# Altium project W2-Tuner_7x7.PrjPcb
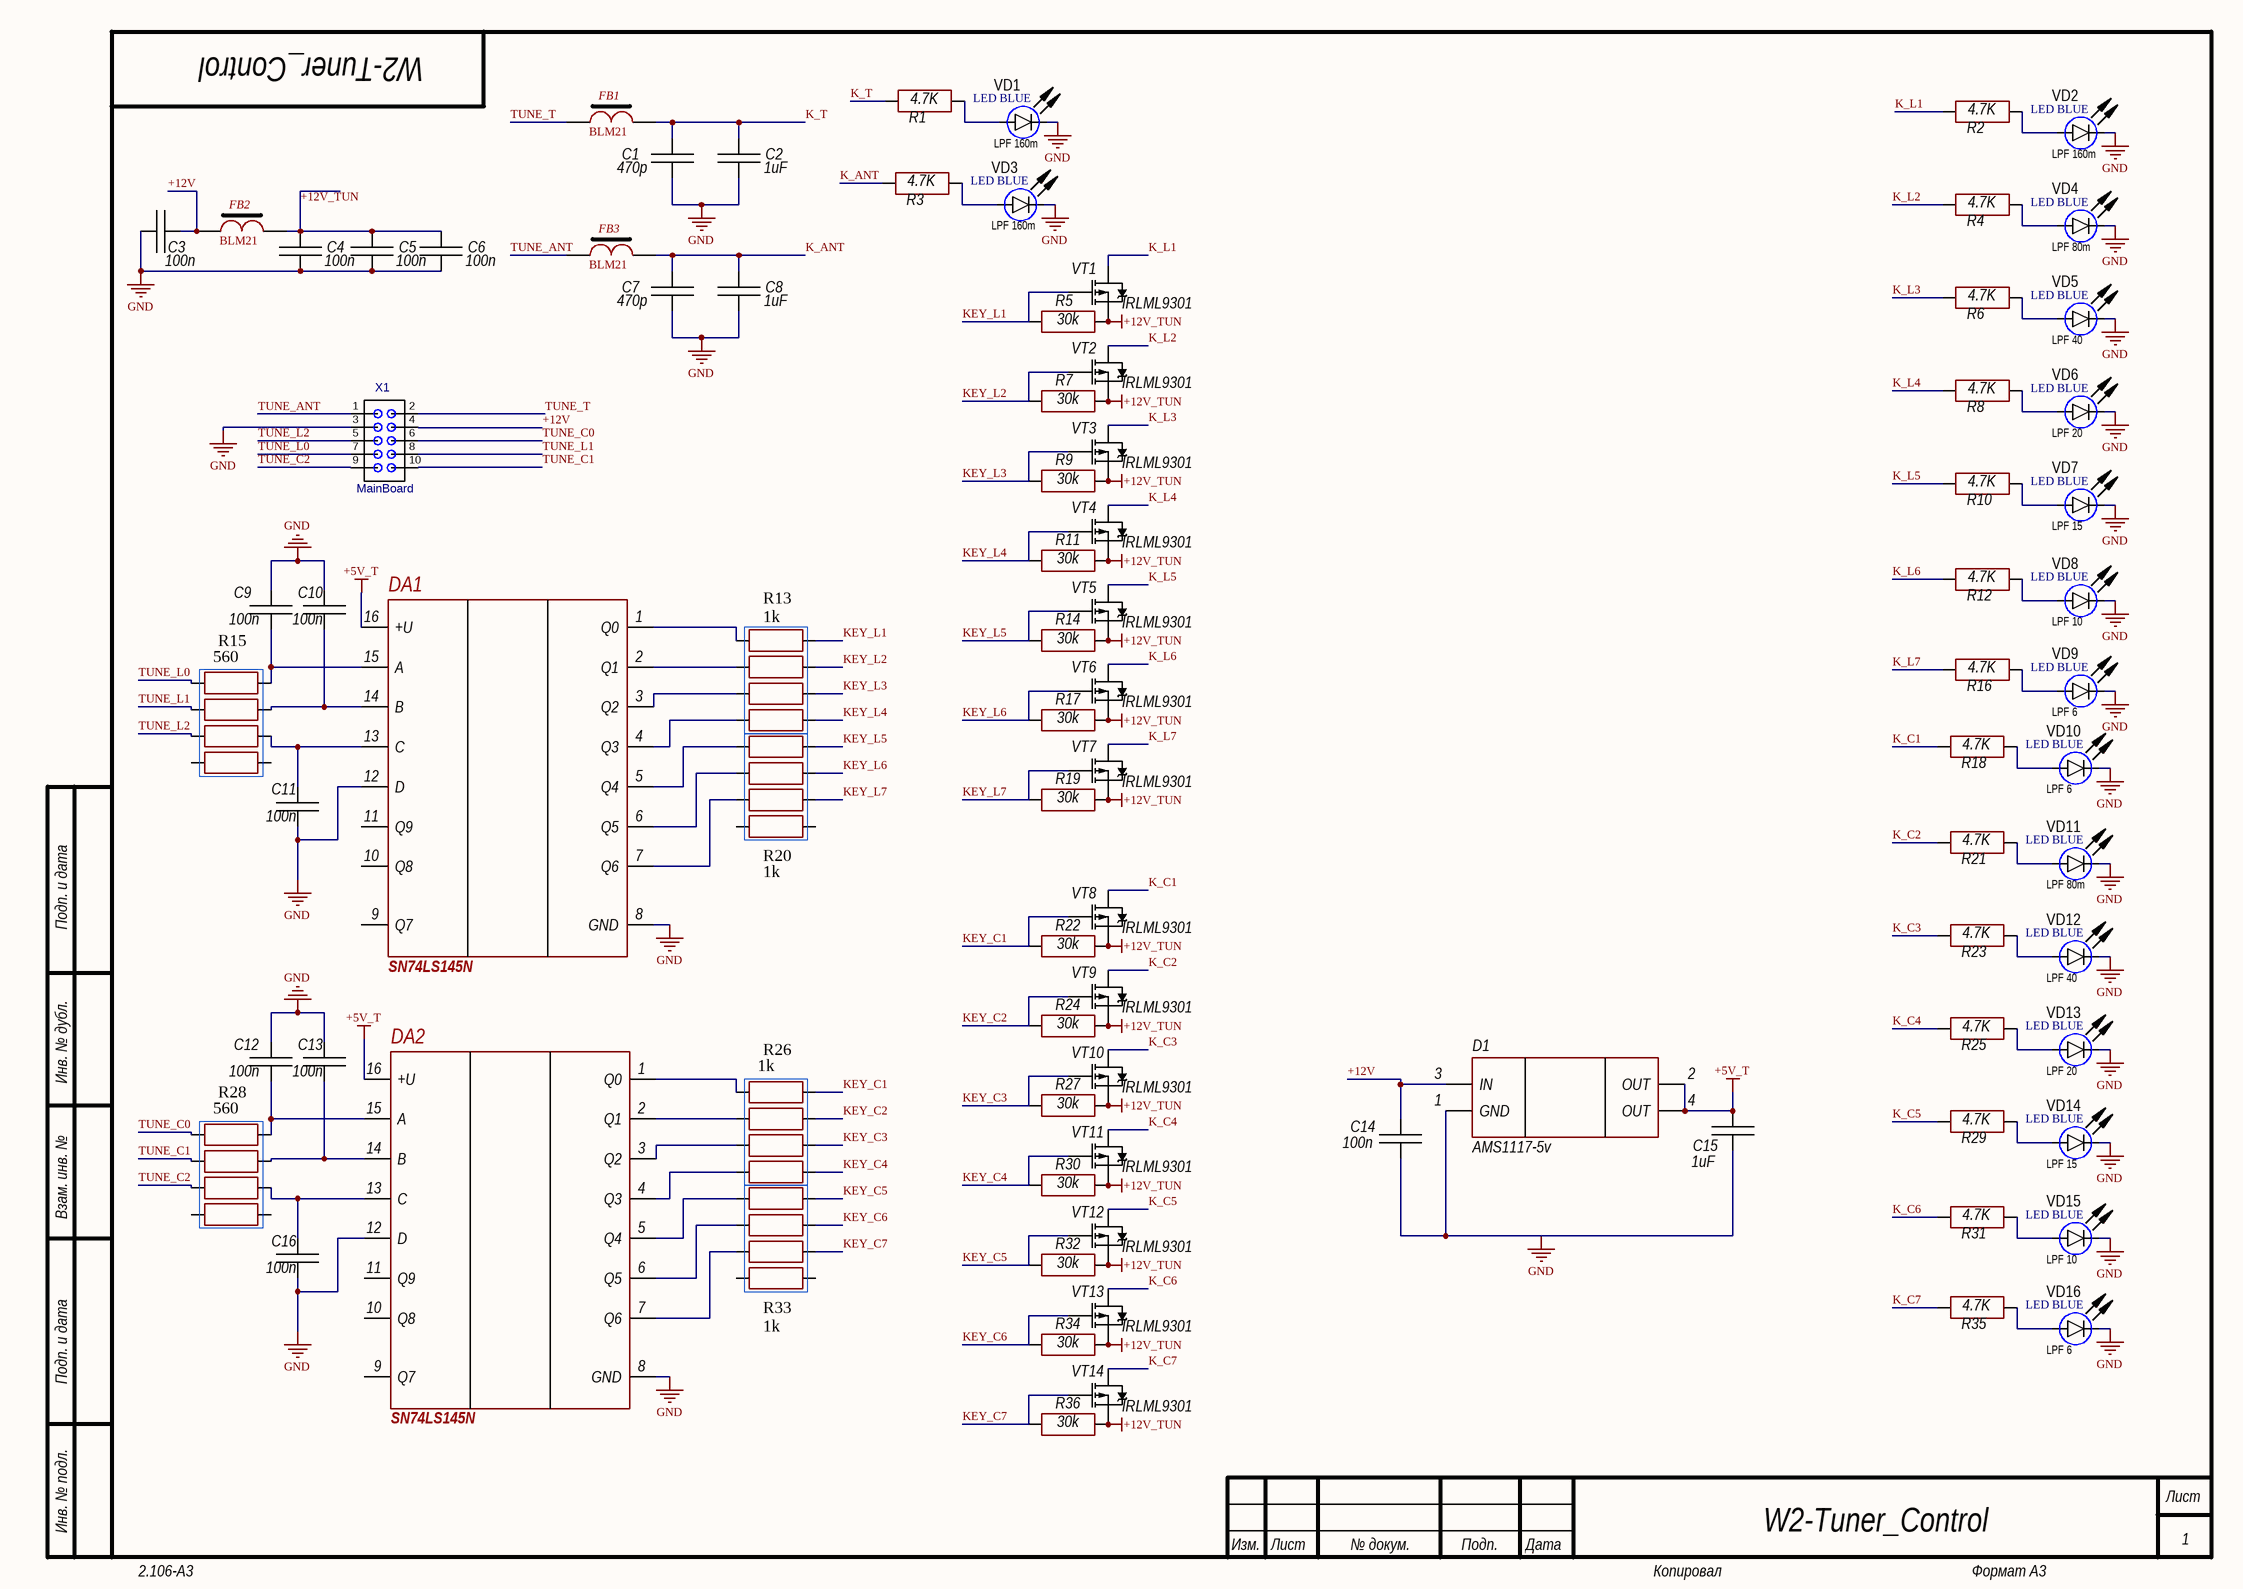
[diagram p0: TUN7_Control.SchDoc]
1 sheet, 89 parts. Net scope: global (net labels, ports and power ports of the same name join across sheets).
Board file: TUN7_PCB.PcbDoc

## Sheet TUN7_Control.SchDoc
size 420 x 297 mm; Date: 04/03/2023; CheckedBy: UA3REO; Author: RU4PN; DrawnBy: UA3REO; DocumentNumber: W2-Tuner_Control; SheetNumber: 1; SheetTotal: 2; Time: 23:01

### Parts
C1  470p  [CH0805C]
C2  1uF  [CH0805C]
C3  100n  [CH0805C]
C4  100n  [CH0805C]
C5  100n  [CH0805C]
C6  100n  [CH0805C]
C7  470p  [CH0805C]
C8  1uF  [CH0805C]
C9  100n  [CH0805C]
C10  100n  [CH0805C]
C11  100n  [CH0805C]
C12  100n  [CH0805C]
C13  100n  [CH0805C]
C14  100n  [CH0805C]
C15  1uF  [CH0805C]
C16  100n  [CH0805C]
D1  AMS1117-5v  [SOT223]
DA1  SN74LS145N  [16-SOP]
DA2  SN74LS145N  [16-SOP]
FB1  BLM21  [CH0805L]
FB2  BLM21  [CH0805L]
FB3  BLM21  [CH0805L]
R1  4.7K  [CH0805R]
R2  4.7K  [CH0805R]
R3  4.7K  [CH0805R]
R4  4.7K  [CH0805R]
R5  30k  [CH0805R]
R6  4.7K  [CH0805R]
R7  30k  [CH0805R]
R8  4.7K  [CH0805R]
R9  30k  [CH0805R]
R10  4.7K  [CH0805R]
R11  30k  [CH0805R]
R12  4.7K  [CH0805R]
R13  1k  [CAT16]
R14  30k  [CH0805R]
R15  560  [CAT16]
R16  4.7K  [CH0805R]
R17  30k  [CH0805R]
R18  4.7K  [CH0805R]
R19  30k  [CH0805R]
R20  1k  [CAT16]
R21  4.7K  [CH0805R]
R22  30k  [CH0805R]
R23  4.7K  [CH0805R]
R24  30k  [CH0805R]
R25  4.7K  [CH0805R]
R26  1k  [CAT16]
R27  30k  [CH0805R]
R28  560  [CAT16]
R29  4.7K  [CH0805R]
R30  30k  [CH0805R]
R31  4.7K  [CH0805R]
R32  30k  [CH0805R]
R33  1k  [CAT16]
R34  30k  [CH0805R]
R35  4.7K  [CH0805R]
R36  30k  [CH0805R]
VD1  LED BLUE  Color: LPF 160m  [LED: 0805B]
VD2  LED BLUE  Color: LPF 160m  [LED: 0805B]
VD3  LED BLUE  Color: LPF 160m  [LED: 0805B]
VD4  LED BLUE  Color: LPF 80m  [LED: 0805B]
VD5  LED BLUE  Color: LPF 40  [LED: 0805B]
VD6  LED BLUE  Color: LPF 20  [LED: 0805B]
VD7  LED BLUE  Color: LPF 15  [LED: 0805B]
VD8  LED BLUE  Color: LPF 10  [LED: 0805B]
VD9  LED BLUE  Color: LPF 6  [LED: 0805B]
VD10  LED BLUE  Color: LPF 6  [LED: 0805B]
VD11  LED BLUE  Color: LPF 80m  [LED: 0805B]
VD12  LED BLUE  Color: LPF 40  [LED: 0805B]
VD13  LED BLUE  Color: LPF 20  [LED: 0805B]
VD14  LED BLUE  Color: LPF 15  [LED: 0805B]
VD15  LED BLUE  Color: LPF 10  [LED: 0805B]
VD16  LED BLUE  Color: LPF 6  [LED: 0805B]
VT1  IRLML9301  [SOT23_132]
VT2  IRLML9301  [SOT23_132]
VT3  IRLML9301  [SOT23_132]
VT4  IRLML9301  [SOT23_132]
VT5  IRLML9301  [SOT23_132]
VT6  IRLML9301  [SOT23_132]
VT7  IRLML9301  [SOT23_132]
VT8  IRLML9301  [SOT23_132]
VT9  IRLML9301  [SOT23_132]
VT10  IRLML9301  [SOT23_132]
VT11  IRLML9301  [SOT23_132]
VT12  IRLML9301  [SOT23_132]
VT13  IRLML9301  [SOT23_132]
VT14  IRLML9301  [SOT23_132]
X1  MainBoard  [CON: BH-10]

### Nets
+5V_T: C15.2 D1.2(OUT) D1.4(OUT) DA1.16(+U) DA2.16(+U)
+12V_TUN: C4.2 C5.2 C6.2 FB2.1 R5.1 R7.1 R9.1 R11.1 R14.1 R17.1 R19.1 R22.1 R24.1 R27.1 R30.1 R32.1 R34.1 R36.1 VT1.2(S) VT2.2(S) VT3.2(S) VT4.2(S) VT5.2(S) VT6.2(S) VT7.2(S) VT8.2(S) VT9.2(S) VT10.2(S) VT11.2(S) VT12.2(S) VT13.2(S) VT14.2(S)
GND: C1.2 C2.2 C3.1 C4.1 C5.1 C6.1 C7.2 C8.2 C9.1 C10.1 C11.2 C12.1 C13.1 C14.1 C15.1 C16.2 D1.1(GND) DA1.8(GND) DA1.12(D) DA2.8(GND) DA2.12(D) VD1.2(C) VD2.2(C) VD3.2(C) VD4.2(C) VD5.2(C) VD6.2(C) VD7.2(C) VD8.2(C) VD9.2(C) VD10.2(C) VD11.2(C) VD12.2(C) VD13.2(C) VD14.2(C) VD15.2(C) VD16.2(C) X1.3
+12V: C3.2 C14.2 D1.3(IN) FB2.2 X1.4
K_ANT: C7.1 C8.1 FB3.1 R3.2
K_C1: R18.2 VT8.3(D)
K_C2: R21.2 VT9.3(D)
K_C3: R23.2 VT10.3(D)
K_C4: R25.2 VT11.3(D)
K_C5: R29.2 VT12.3(D)
K_C6: R31.2 VT13.3(D)
K_C7: R35.2 VT14.3(D)
K_L1: R2.2 VT1.3(D)
K_L2: R4.2 VT2.3(D)
K_L3: R6.2 VT3.3(D)
K_L4: R8.2 VT4.3(D)
K_L5: R10.2 VT5.3(D)
K_L6: R12.2 VT6.3(D)
K_L7: R16.2 VT7.3(D)
K_T: C1.1 C2.1 FB1.1 R1.2
KEY_C1: R22.2 R26.5 VT8.1(G)
KEY_C2: R24.2 R26.6 VT9.1(G)
KEY_C3: R26.7 R27.2 VT10.1(G)
KEY_C4: R26.8 R30.2 VT11.1(G)
KEY_C5: R32.2 R33.5 VT12.1(G)
KEY_C6: R33.6 R34.2 VT13.1(G)
KEY_C7: R33.7 R36.2 VT14.1(G)
KEY_L1: R5.2 R13.5 VT1.1(G)
KEY_L2: R7.2 R13.6 VT2.1(G)
KEY_L3: R9.2 R13.7 VT3.1(G)
KEY_L4: R11.2 R13.8 VT4.1(G)
KEY_L5: R14.2 R20.5 VT5.1(G)
KEY_L6: R17.2 R20.6 VT6.1(G)
KEY_L7: R19.2 R20.7 VT7.1(G)
TUNE_ANT: FB3.2 X1.1
TUNE_C0: R28.1 X1.6
TUNE_C1: R28.2 X1.10
TUNE_C2: R28.3 X1.9
TUNE_L0: R15.1 X1.7
TUNE_L1: R15.2 X1.8
TUNE_L2: R15.3 X1.5
TUNE_T: FB1.2 X1.2
NetC9_2: C9.2 DA1.15(A) R15.5
NetC10_2: C10.2 DA1.14(B) R15.6
NetC11_1: C11.1 DA1.13(C) R15.7
NetC12_2: C12.2 DA2.15(A) R28.5
NetC13_2: C13.2 DA2.14(B) R28.6
NetC16_1: C16.1 DA2.13(C) R28.7
NetDA1_1: DA1.1(Q0) R13.1
NetDA1_2: DA1.2(Q1) R13.2
NetDA1_3: DA1.3(Q2) R13.3
NetDA1_4: DA1.4(Q3) R13.4
NetDA1_5: DA1.5(Q4) R20.1
NetDA1_6: DA1.6(Q5) R20.2
NetDA1_7: DA1.7(Q6) R20.3
NetDA2_1: DA2.1(Q0) R26.1
NetDA2_2: DA2.2(Q1) R26.2
NetDA2_3: DA2.3(Q2) R26.3
NetDA2_4: DA2.4(Q3) R26.4
NetDA2_5: DA2.5(Q4) R33.1
NetDA2_6: DA2.6(Q5) R33.2
NetDA2_7: DA2.7(Q6) R33.3
NetR1_1: R1.1 VD1.1(A)
NetR2_1: R2.1 VD2.1(A)
NetR3_1: R3.1 VD3.1(A)
NetR4_1: R4.1 VD4.1(A)
NetR6_1: R6.1 VD5.1(A)
NetR8_1: R8.1 VD6.1(A)
NetR10_1: R10.1 VD7.1(A)
NetR12_1: R12.1 VD8.1(A)
NetR16_1: R16.1 VD9.1(A)
NetR18_1: R18.1 VD10.1(A)
NetR21_1: R21.1 VD11.1(A)
NetR23_1: R23.1 VD12.1(A)
NetR25_1: R25.1 VD13.1(A)
NetR29_1: R29.1 VD14.1(A)
NetR31_1: R31.1 VD15.1(A)
NetR35_1: R35.1 VD16.1(A)

Not connected (* = marked no-connect by the designer): DA1 9(Q7) 10(Q8) 11(Q9); DA2 9(Q7) 10(Q8) 11(Q9); R15 4 8; R20 4 8; R28 4 8; R33 4 8

### Notes on the sheet
- Подп. и дата
- Инв. № дубл.
- Взам. инв. №
- Инв. № подл.
- Изм.
- Лист
- № докум.
- Подп.
- Дата
- 2.106-A3
- Копировал
- Формат А3

### Library data of the parts
C1-C16 = Capacitor: Manufacturer: *; Model: *; HelpURL: *; ComponentKind: *; Value: *
D1 = NCP1117LPST50T3G: LDO; Manufacturer: ON Semiconductor; Model: NCP1117LPST50T3G; HelpURL: https://www.digikey.com/product-detail/en/on-semiconductor/NCP1117LPST50T3G/NCP1117LPST50T3GOSCT-ND/5801728; ComponentKind: SOT-223
FB1-FB3 = FB-1
R1-R12 R14 R16-R19 R21-R25 R27 R29-R32 R34-R36 = Resistor: Manufacturer: *; Model: *; HelpURL: *; ComponentKind: *; Value: *
R13 R15 R20 R26 R28 R33 = CAT10-0804
VD1-VD16 = LED_single: ValueManufacturerPartNumber: LED, *, *, *, -55...+150°C; Manufacturer: *; Package: *; HelpURL: *; Temperature: -55...+150°C; TypeDiode: LED; Current: *; VoltageDrop: *; PartNumber: *
VT1-VT14 = IRLML9301: Mosfet; Model: *; Manufacturer: *; ComponentKind: *; HelpURL: *
X1 = IDC10: 2*5 Pin